# Altium project ControlAccess.PrjPcb
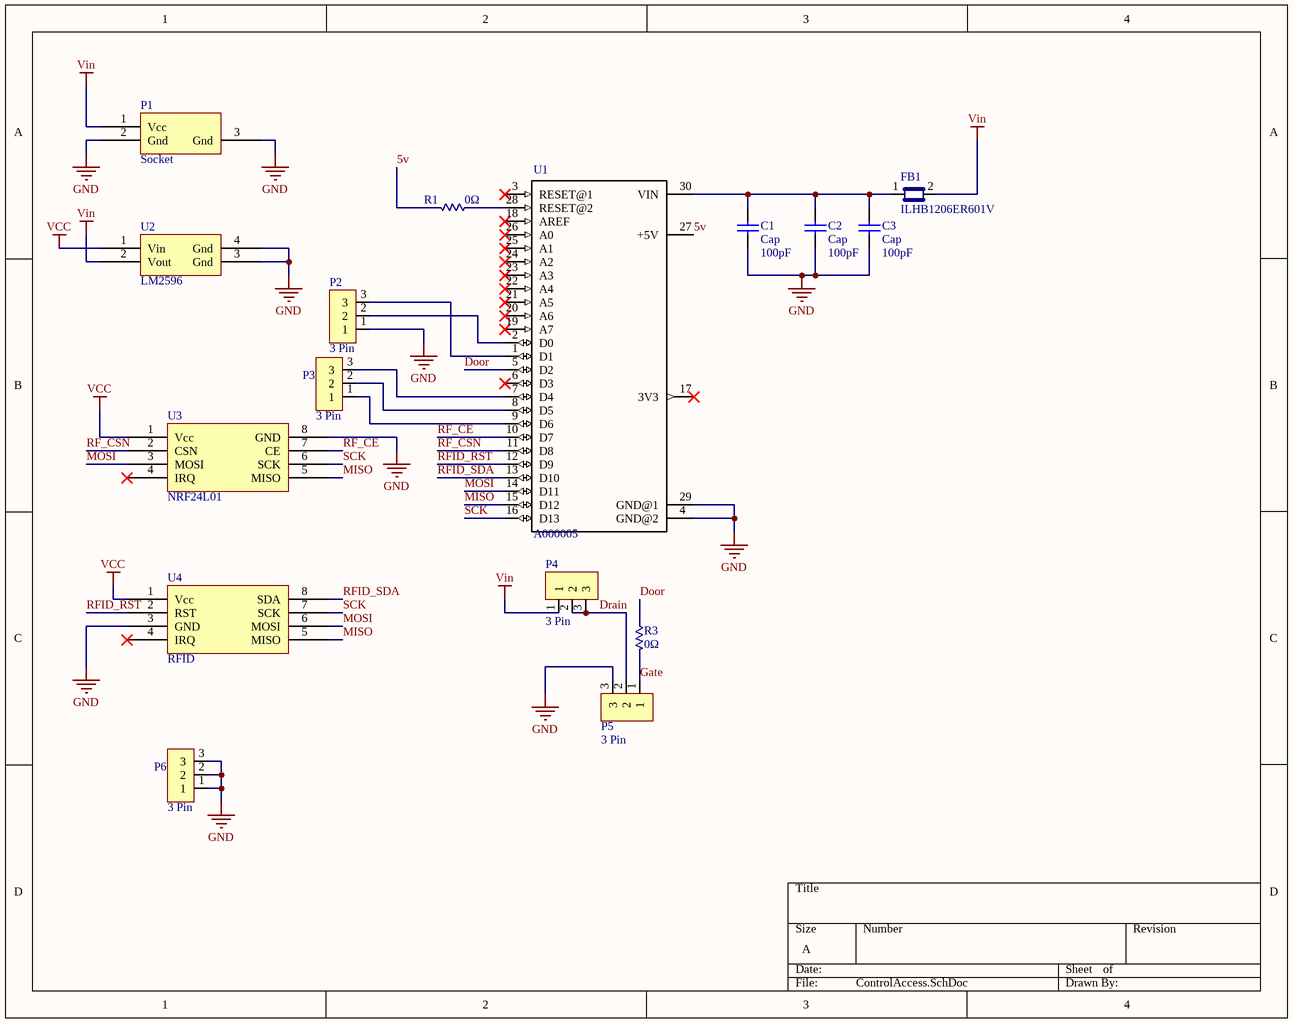
[diagram p0: ControlAccess.SchDoc]
1 sheet, 16 parts. Net scope: global (net labels, ports and power ports of the same name join across sheets).
Board file: ControlAccess.PcbDoc

## Sheet ControlAccess.SchDoc
size A

### Parts
C1  Cap  value 100pF  [RAD-0.3]
C2  Cap  value 100pF  [RAD-0.3]
C3  Cap  value 100pF  [RAD-0.3]
FB1  ILHB1206ER601V  [FB1206]
P1  Socket  [Clema]
P2  3 Pin  [PIN_HEADER_3]
P3  3 Pin  [PIN_HEADER_3]
P4  3 Pin  [PIN_HEADER_3]
P5  3 Pin  [PIN_HEADER_3]
P6  3 Pin  [PIN_HEADER_3]
R1  0Ω  [RES0805]
R3  0Ω  [RES0805]
U1  A000005  [ARDUINO_A000005]
U2  LM2596  [LM2596]
U3  NRF24L01  [NRF24L01]
U4  RFID  [RFID]

### Nets
GND: C1.1 C2.1 C3.1 P1.2(Gnd) P1.3(Gnd) P2.1 P5.3 P6.1 P6.2 P6.3 U1.4(GND@2) U1.29(GND@1) U2.3(Gnd) U2.4(Gnd) U3.8(GND) U4.3(GND)
VCC: U2.1(Vin) U3.1(Vcc) U4.1(Vcc)
Vin: FB1.2 P1.1(Vcc) P4.1 U2.2(Vout)
5v: R1.1 U1.27(+5V)
Door: R3.2 U1.5(D2)
Drain: P4.2 P4.3 P5.2
Gate: P5.1 R3.1
MISO: U1.15(D12) U3.5(MISO) U4.5(MISO)
MOSI: U1.14(D11) U3.3(MOSI) U4.6(MOSI)
RF_CE: U1.10(D7) U3.7(CE)
RF_CSN: U1.11(D8) U3.2(CSN)
RFID_RST: U1.12(D9) U4.2(RST)
RFID_SDA: U1.13(D10) U4.8(SDA)
SCK: U1.16(D13) U3.6(SCK) U4.7(SCK)
NetC1_2: C1.2 C2.2 C3.2 FB1.1 U1.30(VIN)
NetP2_2: P2.2 U1.2(D0)
NetP2_3: P2.3 U1.1(D1)
NetP3_1: P3.1 U1.9(D6)
NetP3_2: P3.2 U1.8(D5)
NetP3_3: P3.3 U1.7(D4)
NetR1_2: R1.2 U1.28(RESET@2)

Not connected (* = marked no-connect by the designer): U1 3(RESET@1)* 6(D3)* 17(3V3)* 18(AREF)* 19(A7)* 20(A6)* 21(A5)* 22(A4)* 23(A3)* 24(A2)* 25(A1)* 26(A0)*; U3 4(IRQ)*; U4 4(IRQ)*

### Library data of the parts
C1-C3 = Cap: Capacitor; Published: 8-Jun-2000; LatestRevisionDate: 17-Jul-2002; LatestRevisionNote: Re-released for DXP Platform.; PackageReference: RAD-0.3; Publisher: Altium Limited; PackageDescription: Radial Cap, Thru-Hole; 2 Leads; 0.3 in Pin Spacing
FB1 = ILHB1206ER601V: Ferrite Beads Multi-Layer High Current 600Ohm 25% 100MHz 2.5A 100mOhm DCR 1206 T/R; Manufacturer: Vishay; Case Size (Inches): 1206; DC Current: 2500 mA; DC Resistance: 0.1 ohm; DELETED: Compliant; Inductance: Not Required uH; Product Depth (mm): 1.8 mm; Product Diameter (mm): Not Required mm; Product Height (mm): 1.3 mm; Product Length (mm): 3.4 mm; Rad Hardened: No; Shielding: Shielded; Type: High Current Bead; Supplier 1: Newark; Manufacturer Part Number: ILHB1206ER601V; Stock 1: 0; Core Material: Ferrite; Failure Rate: Not Required; Impedance: 600 ohm; Military Standard: Not Required; Operating Temp Range: -55C to 125C; Packaging: Tape and Reel; Technology: Multi-Layer; Test Frequency: 100 MHz; Tolerance (+ or -): 25%; ComponentLink1URL: https://datasheet.ciiva.com/3854/ilhb-3854096.pdf; ComponentLink1Description: https://datasheet.ciiva.com/3854/ilhb-3854096.pdf; ComponentLink2URL: https://datasheet.ciiva.com/46636/ilhb-46636117.pdf; ComponentLink2Description: https://datasheet.ciiva.com/46636/ilhb-46636117.pdf; ComponentLink3URL: https://datasheet.ciiva.com/7620/ilhb-7620251.pdf; ComponentLink3Description: https://datasheet.ciiva.com/7620/ilhb-7620251.pdf; ComponentLink4URL: https://datasheet.ciiva.com/6212/ilhb-6212044.pdf; ComponentLink4Description: https://datasheet.ciiva.com/6212/ilhb-6212044.pdf; ComponentLink5URL: https://datasheet.ciiva.com/15160/getdatasheetpartid-45507-15160140.pdf; ComponentLink5Description: https://datasheet.ciiva.com/15160/getdatasheetpartid-45507-15160140.pdf; ComponentLink6URL: https://datasheet.ciiva.com/8494/ilhb-8494783.pdf; ComponentLink6Description: https://datasheet.ciiva.com/8494/ilhb-8494783.pdf; Supplier Part Number 1: 55M4339
P2-P6 = M20-9990246: Headers & Wire Housings 02 SIL VERTICAL PIN HEADER TIN; Manufacturer: Harwin; Connector Type: Header, Unshrouded, Breakaway; Number of Positions: 2; Number of Positions Loaded: All; Pitch: 0.100" (2.54mm); Dynamic Catalog: M20 Series; Mating Products: 952-2227-ND / - SIL FEMALE CRIMP HOUSING 2POS / 952-1776-ND / - 02-WAY SIL VERT SOCKET L/FREE / 952-1775-ND / - 02-WAY SIL VERT SOCKET L/FREE / 952-1774-ND / - 02-WAY SIL HORIZ SOCKET L/FREE; Other Names: 952-2262; Supplier 1: Digi-Key; Manufacturer Part Number: M20-9990246; Stock 1: 38058; Pricing 1: 1=0.11, 10=0.099, 100=0.0609, 500=0.0504, 1000=0.0441, 5000=0.0378, 10000=0.0368 (USD); Standard Package: 1,000; Category: Connectors, Interconnects; Family: Rectangular Connectors - Headers, Male Pins; Series: M20; Contact Type: Male Pin; Number of Rows: 1; Contact Mating Length: 0.240" (6.10mm); Mounting Type: Through Hole; Termination: Solder; Contact Finish: Tin; Color: Black; Packaging: Bulk; ComponentLink1URL: https://datasheet.ciiva.com/8046/315376-8046930.pdf; ComponentLink1Description: https://datasheet.ciiva.com/8046/315376-8046930.pdf; ComponentLink2URL: https://datasheet.ciiva.com/6833/m20-999-6833368.pdf; ComponentLink2Description: https://datasheet.ciiva.com/6833/m20-999-6833368.pdf; ComponentLink3URL: https://datasheet.ciiva.com/11745/0900766b81034e61-11745755.pdf; ComponentLink3Description: https://datasheet.ciiva.com/11745/0900766b81034e61-11745755.pdf; ComponentLink4URL: https://datasheet.ciiva.com/22660/1830818-22660571.pdf; ComponentLink4Description: https://datasheet.ciiva.com/22660/1830818-22660571.pdf; ComponentLink5URL: https://datasheet.ciiva.com/26852/getdatasheetpartid-384170-26852203.pdf; ComponentLink5Description: https://datasheet.ciiva.com/26852/getdatasheetpartid-384170-26852203.pdf; Supplier Part Number 1: 952-2262-ND
R1 R3 = CRT0805-FZ-1002ELF: RES SMD 10K OHM 1% 1/10W 0805; Manufacturer: Bourns; Categoria prodotto: Resistori a pellicola sottile - SMD; Case Height: 0.55 mm; Case Length: 2 mm; Case Width: 1.25 mm; Package/involucro: 0805 (2012 metric); Potenza nominale: 125 mW (1/8 W); Confezione: Reel; Resistenza: 10 kOhms; Range di temperatura di lavoro: - 55 C to + 155 C; Stile di terminazione: SMD/SMT; Power Rating: 100 mW; Temperature Coefficient: 50 PPM / C; Voltage Rating: 100 V; Supplier 1: Digi-Key; Manufacturer Part Number: CRT0805-FZ-1002ELF; Stock 1: 9449; Pricing 1: 1=0.19, 10=0.157, 25=0.1144, 50=0.083, 100=0.0615, 250=0.0472, 500=0.0372, 1000=0.0257 (USD); Case Code - in: 0805; Case Code - mm: 2012; Dimensions: 1.25 mm W x 2 mm L x 0.55 mm H; Operating Temperature Range: - 55 C to + 155 C; Package / Case: 0805 (2012 metric); Packaging: Reel; Produttore: Bourns; RoHS:: Dettagli; Tolleranza: 1 %; Termination Style: SMD/SMT; Product Category: Thin Film Resistors - SMD; RoHS: Details; Resistance: 10 kOhms; Tolerance: 1 %; Product: Precision Resistors Thin Film SMD; Series: CRT; Type: Thin Film Precision Chip Resistor; ComponentLink1URL: https://datasheet.ciiva.com/6548/crt-6548135.pdf; ComponentLink1Description: https://datasheet.ciiva.com/6548/crt-6548135.pdf; ComponentLink2URL: https://datasheet.ciiva.com/6548/crt-6548136.pdf; ComponentLink2Description: https://datasheet.ciiva.com/6548/crt-6548136.pdf; ComponentLink3URL: https://datasheet.ciiva.com/6548/crt-6548137.pdf; ComponentLink3Description: https://datasheet.ciiva.com/6548/crt-6548137.pdf; ComponentLink4URL: https://datasheet.ciiva.com/11810/0900766b80dd0f79-11810955.pdf; ComponentLink4Description: https://datasheet.ciiva.com/11810/0900766b80dd0f79-11810955.pdf; Supplier Part Number 1: CRT0805-FZ-1002ELFCT-ND
U1 = A000005: MICRO, ARDUINO NANO 3.0, MINI-B USB, ATmega328, 0.1DIP, ICSP HDR; SnapEDA_Link: https://www.snapeda.com/symbols-footprints/A000005/Arduino/view-part/?ref=snap; MP: A000005; Availability: Good; Price: 22.93 USD; Package: None; MF: Arduino; Value: *